# EAGLE design DesktopMini (EAGLE 9.4.2)
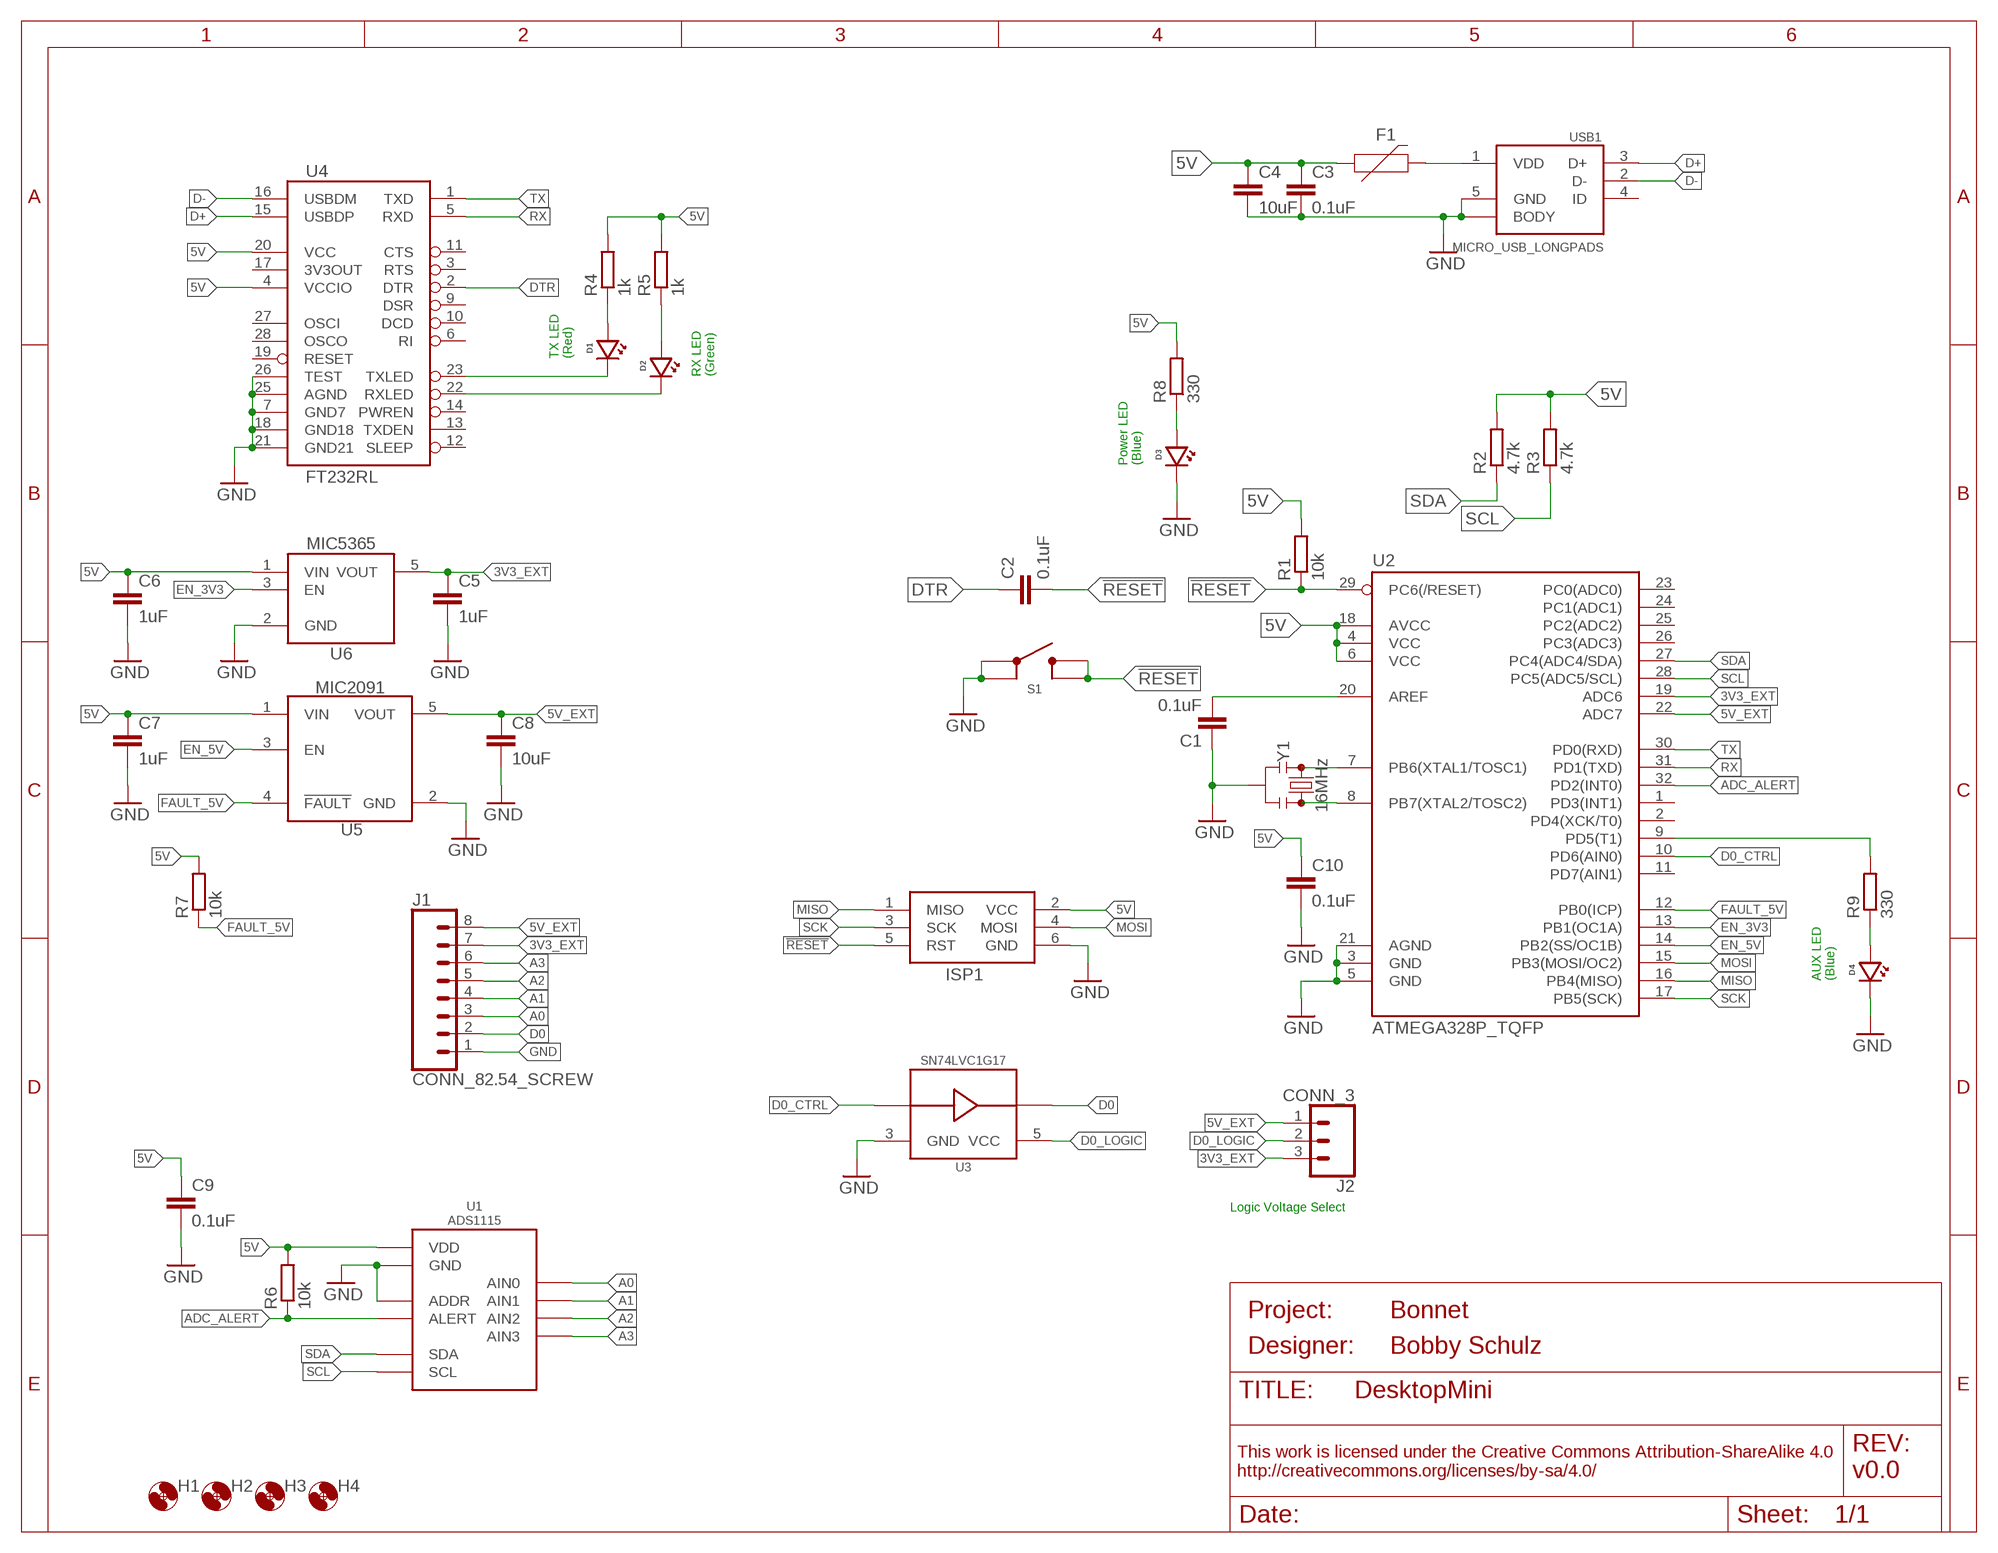
[diagram p0: schematic, sheet 1]
FRAME1 (FRAME_A_L): DESIGNER: Bobby Schulz; PROJECT: Bonnet; REV: v0.0

## Parts
C1  0.1uF  C-EU0.1UFC0603  [C0603]
C2  0.1uF  C-EU0.1UFC0603  [C0603]
C3  0.1uF  C-EU0.1UFC0603  [C0603]
C4  10uF  C-EU10UFC0805  [C0805]
C5  1uF  C-EU1UFC0603  [C0603]
C6  1uF  C-EU1UFC0603  [C0603]
C7  1uF  C-EU1UFC0603  [C0603]
C8  10uF  C-EU10UFC0805  [C0805]
C9  0.1uF  C-EU0.1UFC0603  [C0603]
C10  0.1uF  C-EU0.1UFC0603  [C0603]
D1  LEDRED0603  [LED_0603]
D2  LEDGREEN0603  [LED_0603]
D3  LEDBLUE0603  [LED_0603]
D4  LEDBLUE0603  [LED_0603]
F1  PPTC_HALF-AMP  [1206]
H1  MOUNTING_HOLE4_NP  [4_40]
H2  MOUNTING_HOLE4_NP  [4_40]
H3  MOUNTING_HOLE4_NP  [4_40]
H4  MOUNTING_HOLE4_NP  [4_40]
ISP1  AVRISP-6  [AVRISP]
J1  CONN_82.54_SCREW  [1X08_SCREW]
J2  CONN_3  [1X03]
R1  10k  R-EU_10KR0603  [R0603]
R2  4.7k  R-EU_4.7KR0603  [R0603]
R3  4.7k  R-EU_4.7KR0603  [R0603]
R4  1k  R-EU_1KR0603  [R0603]
R5  1k  R-EU_1KR0603  [R0603]
R6  10k  R-EU_10KR0603  [R0603]
R7  10k  R-EU_10KR0603  [R0603]
R8  330  R-EU_330R0603  [R0603]
R9  330  R-EU_330R0603  [R0603]
S1  BUTTON6X6  [SWITCH_6MM]
U1  ADS1115  [VSSOP_10]
U2  ATMEGA328P_TQFP  ATMEGA328PTQFP_32  [TQFP32-08]
U3  SN74LVC1G17DCK  [DCK_R-PDSO-G5]
U4  FT232RL  FT232RLSSOP  [SSOP28DB]
U5  MIC2091  [SOT23-5]
U6  MIC53653.3SC70  [DCK_R-PDSO-G5]
USB1  MICRO_USB_LONGPADS  [10118194-0001LF_10118194-0001LF_LONGER_PADS]
Y1  16MHz  RESONATOR16MHZSMD_3.2X1.3  [RESONATOR-SMD-3.2X1.3]

## Nets
3V3_EXT: C5.1 J1.7 J2.3 U2.19(ADC6) U6.5(VOUT)
5V: C3.1 C4.1 C6.1 C7.1 C9.1 C10.1 F1.1 ISP1.2(VCC) R1.2 R2.2 R3.2 R4.2 R5.2 R6.2 R7.2 R8.2 U1.8(VDD) U2.4(VCC) U2.6(VCC) U2.18(AVCC) U4.4(VCCIO) U4.20(VCC) U5.1(VIN) U6.1(VIN)
5V_EXT: C8.1 J1.8 J2.1 U2.22(ADC7) U5.5(VOUT)
!RESET: C2.2 ISP1.5(RST) R1.1 S1.3 S1.4 U2.29(PC6(/RESET))
A0: J1.3 U1.4(AIN0)
A1: J1.4 U1.5(AIN1)
A2: J1.5 U1.6(AIN2)
A3: J1.6 U1.7(AIN3)
ADC_ALERT: R6.1 U1.2(ALERT) U2.32(PD2(INT0))
AUX_LED: R9.2 U2.9(PD5(T1))
D0: J1.2 U3.4(Y)
D0_CTRL: U2.10(PD6(AIN0)) U3.2(A)
D0_LOGIC: J2.2 U3.5(VCC)
D+: U4.15(USBDP) USB1.3(D+)
D-: U4.16(USBDM) USB1.2(D-)
DTR: C2.1 U4.2(DTR)
EN_3V3: U2.13(PB1(OC1A)) U6.3(EN)
EN_5V: U2.14(PB2(SS/OC1B)) U5.3(EN)
FAULT_5V: R7.1 U2.12(PB0(ICP)) U5.4(!FAULT)
GND: C1.1 C3.2 C4.2 C5.2 C6.2 C7.2 C8.2 C9.2 C10.2 D3.CATHODE D4.CATHODE ISP1.6(GND) J1.1 S1.1 S1.2 U1.1(ADDR) U1.3(GND) U2.3(GND) U2.5(GND) U2.21(AGND) U3.3(GND) U4.7(GND7) U4.18(GND18) U4.21(GND21) U4.25(AGND) U4.26(TEST) U5.2(GND) U6.2(GND) USB1.5(GND) USB1.BODY@1(BODY) USB1.BODY@2(BODY) USB1.BODY@3(BODY) USB1.BODY@4(BODY) USB1.BODY@7(BODY) USB1.BODY@8(BODY) Y1.2
MISO: ISP1.1(MISO) U2.16(PB4(MISO))
MOSI: ISP1.4(MOSI) U2.15(PB3(MOSI/OC2))
N$1: U2.7(PB6(XTAL1/TOSC1)) Y1.1
N$2: U2.8(PB7(XTAL2/TOSC2)) Y1.3
N$3: C1.2 U2.20(AREF)
N$5: D1.ANODE R4.1
N$6: F1.2 USB1.1(VDD)
N$7: D2.ANODE R5.1
N$8: D1.CATHODE U4.23(TXLED)
N$9: D2.CATHODE U4.22(RXLED)
N$10: D3.ANODE R8.1
N$11: D4.ANODE R9.1
RX: U2.31(PD1(TXD)) U4.5(RXD)
SCK: ISP1.3(SCK) U2.17(PB5(SCK))
SCL: R3.1 U1.10(SCL) U2.28(PC5(ADC5/SCL))
SDA: R2.1 U1.9(SDA) U2.27(PC4(ADC4/SDA))
TX: U2.30(PD0(RXD)) U4.1(TXD)
Unconnected: U2.1(PD3(INT1)) U2.2(PD4(XCK/T0)) U2.11(PD7(AIN1)) U2.23(PC0(ADC0)) U2.24(PC1(ADC1)) U2.25(PC2(ADC2)) U2.26(PC3(ADC3)) U4.3(RTS) U4.6(RI) U4.9(DSR) U4.10(DCD) U4.11(CTS) U4.12(SLEEP) U4.13(TXDEN) U4.14(PWREN) U4.17(3V3OUT) U4.19(RESET) U4.27(OSCI) U4.28(OSCO) USB1.4(ID)

## Notes on the sheet
- TX LED
  (Red)
- RX LED
  (Green)
- Power LED
  (Blue)
- AUX LED
  (Blue)
- Logic Voltage Select

## Library data of the parts
C1-C3 C9 C10 = bschulz_passives:C-EU: CAPACITOR, European symbol; DIGIKEY: 490-6051-1-ND; MF: Murata; MPN: GCM188R71E104KA57D
C4 C8 = bschulz_passives:C-EU: CAPACITOR, European symbol; DIGIKEY: 490-6473-6-ND; MF: Murata; MPN: GRM21BR61C106KE15K
C5-C7 = bschulz_passives:C-EU: CAPACITOR, European symbol; DIGIKEY: 587-1251-1-ND; MF: Yaiyo Yuden; MPN: EMK107BJ105KA-T
D1 = bschulz:LED: Genaric LED; DIGIKEY: 732-4978-1-ND; MF: Wurth; MPN: 150060RS75000
D2 = bschulz:LED: Genaric LED; DIGIKEY: 732-4971-1-ND; MF: Wurth; MPN: 150060GS75000
D3 D4 = bschulz:LED: Genaric LED; DIGIKEY: 732-4966-1-ND; MF: Wurth; MPN: 150060BS75000
F1 = bschulz:PPTC: Bel Fuse PPTC; DIGIKEY: MF-NSMF020-2CT-ND; MF: Bourns; MPN: MF-NSMF020-2
H1-H4 = bschulz:MOUNTING_HOLE: Genaric Mechanical Mounting Hole Hole diameter based on max body diameter + 15% Keepout ring is for diameter of socket cap screw (minimum required clearance) TPlace ring is for diameter of pan head screw (recomended clearance) Specifications: Socket Cap <http://fastener-express.com/fastener-technical/SocketscapSS-Alloy.pdf> Button Head Socket Cap <http://fastener-express.com/fastener-technical/Button-Socket-alloy.pdf> Pan Head <http://fastener-express.com/fastener-technical/pan-machine-Screws.pdf>; DIGIKEY: DNP; MF: N/A; MPN: DNP
ISP1 = bschulz:AVRISP: AVR ISP HEADER Standard 6 pin header for AVR programming
J1 = bschulz:CONN_8: Genaric 8 terminal header Digikey 2.54_SCREW <https://www.digikey.com/product-detail/en/on-shore-technology-inc/OSTVN06A150/ED10565-ND/1588866>; DIGIKEY: ED10566-ND; MF: On Shore; MPN: OSTVN08A150
J2 = bschulz:CONN_3: Genaric 3 terminal header Digikey 2.54_SCREW <https://www.digikey.com/product-detail/en/on-shore-technology-inc/OSTVN03A150/ED10562-ND/1588863> 3.5_SCREW <https://www.digikey.com/product-detail/en/on-shore-technology-inc/OSTTE030161/ED2636-ND/614585>
R1 R6 R7 = bschulz_passives:R-EU_: RESISTOR, European symbol Digikey Parts: Yageo, 0402 <https://www.digikey.com/products/en/resistors/chip-resistor-surface-mount/52?k=&pkeyword=&sv=0&s=4356&sf=1&FV=-1%7C13%2C7%7C2%2C1291%7C39157%2C1989%7C0%2C-8%7C52%2C3%7C1131%2C3%7C2503&quantity=&ColumnSort=0&page=1&stock=1&pageSize=25> Yageo, 0603 <https://www.digikey.com/products/en/resistors/chip-resistor-surface-mount/52?k=&pkeyword=&sv=0&pv1291=39245&sf=1&FV=-5%7C4356%2C-5%7C47360%2C-8%7C52%2C-1%7C13%2C7%7C2%2C1989%7C0&quantity=10&ColumnSort=1000011&page=1&stock=1&pageSize=25> Panasonic, 0603 <https://www.digikey.com/products/en/resistors/chip-resistor-surface-mount/52?k=&pkeyword=&pv252=68&sf=0&FV=ffec373d%2C1c0002%2C142c040c%2C1f140000%2Cffe00034%2C80002%2Cc0001&quantity=&ColumnSort=0&page=1&stock=1&pageSize=25> Panasonic, precision, 0603 <https://www.digikey.com/products/en/resistors/chip-resistor-surface-mount/52?FV=ffec4907%2Cfffc000a%2Cc0172%2C142c040c%2C1f140000%2Cffe00034%2C1c0002&quantity=100&ColumnSort=2085&page=1&stock=1&pageSize=25> Panasonic, 0805 <https://www.digikey.com/products/en/resistors/chip-resistor-surface-mount/52?k=&pkeyword=&pv3=1&sf=0&FV=ffec373d%2C1c0002%2C1f140000%2Cffe00034%2C142c040d&quantity=&ColumnSort=0&page=1&stock=1&pageSize=25> Rohm, current sense <https://www.digikey.com/products/en/resistors/chip-resistor-surface-mount/52?k=&pkeyword=&pv3=1&sf=0&FV=ffecb688%2C1f140000%2Cffe00034%2C1c0002&quantity=&ColumnSort=0&page=1&stock=1&pageSize=25> Vishay, pulse proof automotive <https://www.digikey.com/products/en/resistors/chip-resistor-surface-mount/52?k=&pkeyword=&pv7=2&sf=0&FV=ffec5d6b%2Cffe00034%2C1f140000&quantity=&ColumnSort=0&page=1&stock=1&pageSize=25>; DIGIKEY: 311-10.0KHRCT-ND; MF: Yageo; MPN: RC0603FR-0710KL; VALUE_PART: 10k
R2 R3 = bschulz_passives:R-EU_: RESISTOR, European symbol Digikey Parts: Yageo, 0402 <https://www.digikey.com/products/en/resistors/chip-resistor-surface-mount/52?k=&pkeyword=&sv=0&s=4356&sf=1&FV=-1%7C13%2C7%7C2%2C1291%7C39157%2C1989%7C0%2C-8%7C52%2C3%7C1131%2C3%7C2503&quantity=&ColumnSort=0&page=1&stock=1&pageSize=25> Yageo, 0603 <https://www.digikey.com/products/en/resistors/chip-resistor-surface-mount/52?k=&pkeyword=&sv=0&pv1291=39245&sf=1&FV=-5%7C4356%2C-5%7C47360%2C-8%7C52%2C-1%7C13%2C7%7C2%2C1989%7C0&quantity=10&ColumnSort=1000011&page=1&stock=1&pageSize=25> Panasonic, 0603 <https://www.digikey.com/products/en/resistors/chip-resistor-surface-mount/52?k=&pkeyword=&pv252=68&sf=0&FV=ffec373d%2C1c0002%2C142c040c%2C1f140000%2Cffe00034%2C80002%2Cc0001&quantity=&ColumnSort=0&page=1&stock=1&pageSize=25> Panasonic, precision, 0603 <https://www.digikey.com/products/en/resistors/chip-resistor-surface-mount/52?FV=ffec4907%2Cfffc000a%2Cc0172%2C142c040c%2C1f140000%2Cffe00034%2C1c0002&quantity=100&ColumnSort=2085&page=1&stock=1&pageSize=25> Panasonic, 0805 <https://www.digikey.com/products/en/resistors/chip-resistor-surface-mount/52?k=&pkeyword=&pv3=1&sf=0&FV=ffec373d%2C1c0002%2C1f140000%2Cffe00034%2C142c040d&quantity=&ColumnSort=0&page=1&stock=1&pageSize=25> Rohm, current sense <https://www.digikey.com/products/en/resistors/chip-resistor-surface-mount/52?k=&pkeyword=&pv3=1&sf=0&FV=ffecb688%2C1f140000%2Cffe00034%2C1c0002&quantity=&ColumnSort=0&page=1&stock=1&pageSize=25> Vishay, pulse proof automotive <https://www.digikey.com/products/en/resistors/chip-resistor-surface-mount/52?k=&pkeyword=&pv7=2&sf=0&FV=ffec5d6b%2Cffe00034%2C1f140000&quantity=&ColumnSort=0&page=1&stock=1&pageSize=25>; DIGIKEY: 311-4.70KHRCT-ND; MF: Yageo; MPN: RC0603FR-074K7L; VALUE_PART: 4.7k
R4 R5 = bschulz_passives:R-EU_: RESISTOR, European symbol Digikey Parts: Yageo, 0402 <https://www.digikey.com/products/en/resistors/chip-resistor-surface-mount/52?k=&pkeyword=&sv=0&s=4356&sf=1&FV=-1%7C13%2C7%7C2%2C1291%7C39157%2C1989%7C0%2C-8%7C52%2C3%7C1131%2C3%7C2503&quantity=&ColumnSort=0&page=1&stock=1&pageSize=25> Yageo, 0603 <https://www.digikey.com/products/en/resistors/chip-resistor-surface-mount/52?k=&pkeyword=&sv=0&pv1291=39245&sf=1&FV=-5%7C4356%2C-5%7C47360%2C-8%7C52%2C-1%7C13%2C7%7C2%2C1989%7C0&quantity=10&ColumnSort=1000011&page=1&stock=1&pageSize=25> Panasonic, 0603 <https://www.digikey.com/products/en/resistors/chip-resistor-surface-mount/52?k=&pkeyword=&pv252=68&sf=0&FV=ffec373d%2C1c0002%2C142c040c%2C1f140000%2Cffe00034%2C80002%2Cc0001&quantity=&ColumnSort=0&page=1&stock=1&pageSize=25> Panasonic, precision, 0603 <https://www.digikey.com/products/en/resistors/chip-resistor-surface-mount/52?FV=ffec4907%2Cfffc000a%2Cc0172%2C142c040c%2C1f140000%2Cffe00034%2C1c0002&quantity=100&ColumnSort=2085&page=1&stock=1&pageSize=25> Panasonic, 0805 <https://www.digikey.com/products/en/resistors/chip-resistor-surface-mount/52?k=&pkeyword=&pv3=1&sf=0&FV=ffec373d%2C1c0002%2C1f140000%2Cffe00034%2C142c040d&quantity=&ColumnSort=0&page=1&stock=1&pageSize=25> Rohm, current sense <https://www.digikey.com/products/en/resistors/chip-resistor-surface-mount/52?k=&pkeyword=&pv3=1&sf=0&FV=ffecb688%2C1f140000%2Cffe00034%2C1c0002&quantity=&ColumnSort=0&page=1&stock=1&pageSize=25> Vishay, pulse proof automotive <https://www.digikey.com/products/en/resistors/chip-resistor-surface-mount/52?k=&pkeyword=&pv7=2&sf=0&FV=ffec5d6b%2Cffe00034%2C1f140000&quantity=&ColumnSort=0&page=1&stock=1&pageSize=25>; DIGIKEY: 311-1KLDCT-ND; MF: Yageo; MPN: AC0603FR-071KL; VALUE_PART: 1k
R8 R9 = bschulz_passives:R-EU_: RESISTOR, European symbol Digikey Parts: Yageo, 0402 <https://www.digikey.com/products/en/resistors/chip-resistor-surface-mount/52?k=&pkeyword=&sv=0&s=4356&sf=1&FV=-1%7C13%2C7%7C2%2C1291%7C39157%2C1989%7C0%2C-8%7C52%2C3%7C1131%2C3%7C2503&quantity=&ColumnSort=0&page=1&stock=1&pageSize=25> Yageo, 0603 <https://www.digikey.com/products/en/resistors/chip-resistor-surface-mount/52?k=&pkeyword=&sv=0&pv1291=39245&sf=1&FV=-5%7C4356%2C-5%7C47360%2C-8%7C52%2C-1%7C13%2C7%7C2%2C1989%7C0&quantity=10&ColumnSort=1000011&page=1&stock=1&pageSize=25> Panasonic, 0603 <https://www.digikey.com/products/en/resistors/chip-resistor-surface-mount/52?k=&pkeyword=&pv252=68&sf=0&FV=ffec373d%2C1c0002%2C142c040c%2C1f140000%2Cffe00034%2C80002%2Cc0001&quantity=&ColumnSort=0&page=1&stock=1&pageSize=25> Panasonic, precision, 0603 <https://www.digikey.com/products/en/resistors/chip-resistor-surface-mount/52?FV=ffec4907%2Cfffc000a%2Cc0172%2C142c040c%2C1f140000%2Cffe00034%2C1c0002&quantity=100&ColumnSort=2085&page=1&stock=1&pageSize=25> Panasonic, 0805 <https://www.digikey.com/products/en/resistors/chip-resistor-surface-mount/52?k=&pkeyword=&pv3=1&sf=0&FV=ffec373d%2C1c0002%2C1f140000%2Cffe00034%2C142c040d&quantity=&ColumnSort=0&page=1&stock=1&pageSize=25> Rohm, current sense <https://www.digikey.com/products/en/resistors/chip-resistor-surface-mount/52?k=&pkeyword=&pv3=1&sf=0&FV=ffecb688%2C1f140000%2Cffe00034%2C1c0002&quantity=&ColumnSort=0&page=1&stock=1&pageSize=25> Vishay, pulse proof automotive <https://www.digikey.com/products/en/resistors/chip-resistor-surface-mount/52?k=&pkeyword=&pv7=2&sf=0&FV=ffec5d6b%2Cffe00034%2C1f140000&quantity=&ColumnSort=0&page=1&stock=1&pageSize=25>; DIGIKEY: 311-330HRCT-ND; MF: Yageo; MPN: RC0603FR-07330RL; VALUE_PART: 330
S1 = bschulz:BUTTON: Genaric SPST Push button
U1 = bschulz:ADS111*: ADS1115 - Sigma Delta ADC Characteristics: VCC: 2~5.5V Resolution: 16 bits (12 bits for ADS1015) Number of Inputs: 4 (2 Differenital) Sample Rate: 860 Samples Per Second (3300 for ADS1015) Operating Temperature: -40°C to 125°C Digikey: 296-38849-1-ND (ADS1115) <https://www.digikey.com/scripts/DkSearch/dksus.dll?Detail&itemSeq=258904888&uq=636603311183646020> 296-41185-1-ND (ADS1015) <https://www.digikey.com/product-detail/en/texas-instruments/ADS1015IDGSR/296-41185-1-ND/5222640>; DIGIKEY: 296-38849-1-ND; MF: TI; MPN: ADS1115IDGSR
U2 = bschulz:ATMEGA328P: Popular 328P in QFP Storefront component: ATmega328 - TQFP <https://www.sparkfun.com/products/13448> (COM-13448) Datasheet <http://www.sparkfun.com/datasheets/Components/SMD/ATMega328.pdf> SparkFun Products SparkFun RedBoard - Programmed with Arduino <https://www.sparkfun.com/products/12757> (DEV-12757) Arduino Pro Mini 328 - 5V/16MHz <https://www.sparkfun.com/products/11113> (DEV-11113) Arduino Pro Mini 328 - 3.3V/8MHz <https://www.sparkfun.com/products/11114> (DEV-11114) SparkFun OpenLog <https://www.sparkfun.com/products/13712> (DEV-13712) SparkFun MicroView - OLED Arduino Module <https://www.sparkfun.com/products/12923> (DEV-12923) SparkFun Digital Sandbox <https://www.sparkfun.com/products/12651> (DEV-12651) SparkFun PicoBoard <https://www.sparkfun.com/products/11888> (WIG-11888) Arduino Fio <https://www.sparkfun.com/products/10116> (DEV-10116) LilyPad Arduino 328 Main Board <https://www.sparkfun.com/products/13342> (DEV-13342) SparkFun RedStick <https://www.sparkfun.com/products/13741> (DEV-13741) LilyPad MP3 <https://www.sparkfun.com/products/11013> (DEV-11013) LilyPad Arduino SimpleSnap <https://www.sparkfun.com/products/10941> (DEV-10941) SparkFun Stepoko <https://www.sparkfun.com/products/13899> (ROB-13899) SparkFun Geiger Counter <https://www.sparkfun.com/products/11345> (SEN-11345) SparkFun EL Sequencer <https://www.sparkfun.com/products/12781> (COM-12781) Arduino Pro 328 - 5V/16MHz <https://www.sparkfun.com/products/10915> (DEV-10915) CryptoCape <https://www.sparkfun.com/products/12773> (DEV-12773) SparkFun IR Thermometer Evaluation Board - MLX90614 <https://www.sparkfun.com/products/10740> (SEN-10740) SparkFun RedBot Mainboard <https://www.sparkfun.com/products/12097> (ROB-12097) Arduino Pro 328 - 3.3V/8MHz <https://www.sparkfun.com/products/10914> (DEV-10914) SparkFun Block for Intel® Edison - Arduino <https://www.sparkfun.com/products/13036> (DEV-13036) SparkFun Simon Says - Surface Mount Soldering Kit <https://www.sparkfun.com/products/10935> (KIT-10935) SparkFun 7-Segment Serial Display - Red <https://www.sparkfun.com/products/11441> (COM-11441) SparkFun 7-Segment Serial Display - White <https://www.sparkfun.com/products/11629> (COM-11629) SparkFun 7-Segment Serial Display - Yellow <https://www.sparkfun.com/products/11443> (COM-11443) SparkFun 7-Segment Serial Display - Kelly Green <https://www.sparkfun.com/products/11440> (COM-11440) SparkFun 7-Segment Serial Display - Blue <https://www.sparkfun.com/products/11442> (COM-11442) SparkFun OpenSegment Serial Display - 20mm (Blue) <https://www.sparkfun.com/products/11647> (COM-11647) SparkFun OpenSegment Serial Display - 20mm (Green) <https://www.sparkfun.com/products/11646> (COM-11646) SparkFun OpenSegment Serial Display - 20mm (White) <https://www.sparkfun.com/products/11648> (COM-11648) SparkFun OpenSegment Serial Display - 20mm (Red) <https://www.sparkfun.com/products/11644> (COM-11644) SparkFun OpenSegment Serial Display - 20mm (Yellow) <https://www.sparkfun.com/products/11645> (COM-11645) SparkFun OpenSegment Shield <https://www.sparkfun.com/products/13190> (DEV-13190); DIGIKEY: ATMEGA328PB-AURCT-ND; MF: Atmel; MPN: ATMEGA328PB-AUR; PROD_ID: IC-09069
U3 = bschulz:SN74LVC1G17: SN74LVC1G17 - Single Schmitt Trigger Logic Buffer Characteristics: VCC: 1.65~5.5V Operating Temperature: -40°C to 125°C Number of Gates: 1 /li> Inverting: No 5V Tolerent Input (Down Shift) Digikey: 296-11934-1-ND (SC70, DCK) <https://www.digikey.com/product-detail/en/texas-instruments/SN74LVC1G17DCKR/296-11934-1-ND/389052>; DIGIKEY: 296-11934-1-ND; DISP: SN74LVC1G17; MF: TI; MPN: SN74LVC1G17DCKR
U4 = bschulz:FT232RL: FT232RL USB UART FT232RL 4th Generation USB UART (USB <-> Serial) Controller. Datasheet <http://www.sparkfun.com/datasheets/IC/FT232R_v104.pdf> SparkFun Products Component <https://www.sparkfun.com/products/650> (COM-00650) SparkFun RedBot Mainboard <https://www.sparkfun.com/products/12097> (ROB-12097) SparkFun FTDI Basic Breakout - 5V <https://www.sparkfun.com/products/9716> (DEV-09716) SparkFun FTDI Basic Breakout - 3.3V <https://www.sparkfun.com/products/9873> (DEV-09873) Bus Pirate - v3.6a <https://www.sparkfun.com/products/12942> (TOL-12942) SparkFun USB to Serial Breakout - FT232RL <https://www.sparkfun.com/products/12731> (BOB-12731) SparkFun PicoBoard <https://www.sparkfun.com/products/11888> (WIG-11888) SparkFun RFID USB Reader <https://www.sparkfun.com/products/9963> (SEN-09963) LilyPad FTDI Basic Breakout - 5V <https://www.sparkfun.com/products/10275> (DEV-10275) SparkFun Stepoko <https://www.sparkfun.com/products/13899> (ROB-13899); PROD_ID: IC-00870
U5 = bschulz:MIC209*: MIC209x - Hight Side Load Switch, with Fixed Current Limit Characteristics: Vin: 1.8v ~ 5.5v IQ: 5μA (OFF), 70μA (ON) RDS(ON): 700mΩ (Vin = 5v), 790mΩ (Vin = 3.3v) UVLO: 1.75V Output Current: 50/100mA (MIC2090/MIC2091) Operating Temperature: -40°C to 125°C Digikey: MIC2091-1 <https://www.digikey.com/product-detail/en/microchip-technology/MIC2091-1YM5-TR/576-3891-1-ND/2650466> MIC2090-1 <https://www.digikey.com/product-detail/en/microchip-technology/MIC2090-1YM5-TR/576-3890-1-ND/2650465>; DIGIKEY: 576-3891-1-ND; DISP: MIC2091; MF: Microchip; MPN: MIC2091-1YM5-TR
U6 = bschulz:MIC5365: MIC5365-* - Low Power, High Performance, Linear Regulator Characteristics: Vin: 2.5V ~ 5.5V Vout: Many options, (1v ~ 3.3v) see datasheet <http://ww1.microchip.com/downloads/en/DeviceDoc/mic5365.pdf> IQ: 29μA typ Dropout Voltage: 55mV @ 50mA, input ≥ 2.8v Voltage Accuracy: 2% typ Output Current: 150 mA Operating Temperature: -40°C to 125°C Mouser: MIC5365-3.3YC5 (3.3V Fixed) <https://www.digikey.com/product-detail/en/microchip-technology/MIC5365-3.3YC5-TR/576-3193-1-ND/1868230> MIC5365-1.8YC5 (1.8V Fixed) <https://www.digikey.com/products/en/integrated-circuits-ics/pmic-voltage-regulators-linear/699?k=mic5365&k=&pkeyword=mic5365&sv=0&pv1291=881&sf=0&FV=1c0002%2C1f140000%2Cffe002bb%2C1bcc0020&quantity=&ColumnSort=0&page=1&stock=1&pageSize=25>; DIGIKEY: 576-3193-1-ND; MF: Microchip; MPN: MIC5365-3.3YC5-TR
USB1 = bschulz:MICRO_USB_LONGPADS; DIGIKEY: 609-4618-1-ND; MF: Amphenol; MPN: 10118194-0001LF
Y1 = bschulz:RESONATOR: 16MHz Resonator Digikey Example <http://www.digikey.com/product-detail/en/murata-electronics-north-america/CSTCE16M0V53-R0/490-1198-1-ND/584635> Frequency: 16MHz Frequency Stability: ±0.3% Frequency Tolerance: ±0.5% Capacitance: 15pF SparkFun Products SparkFun OpenLog <https://www.sparkfun.com/products/13712> SparkFun MicroView - OLED Arduino Module <https://www.sparkfun.com/products/12923>; DIGIKEY: 490-17948-1-ND; MF: Murata; MPN: CSTNE16M0V530000R0

## Board
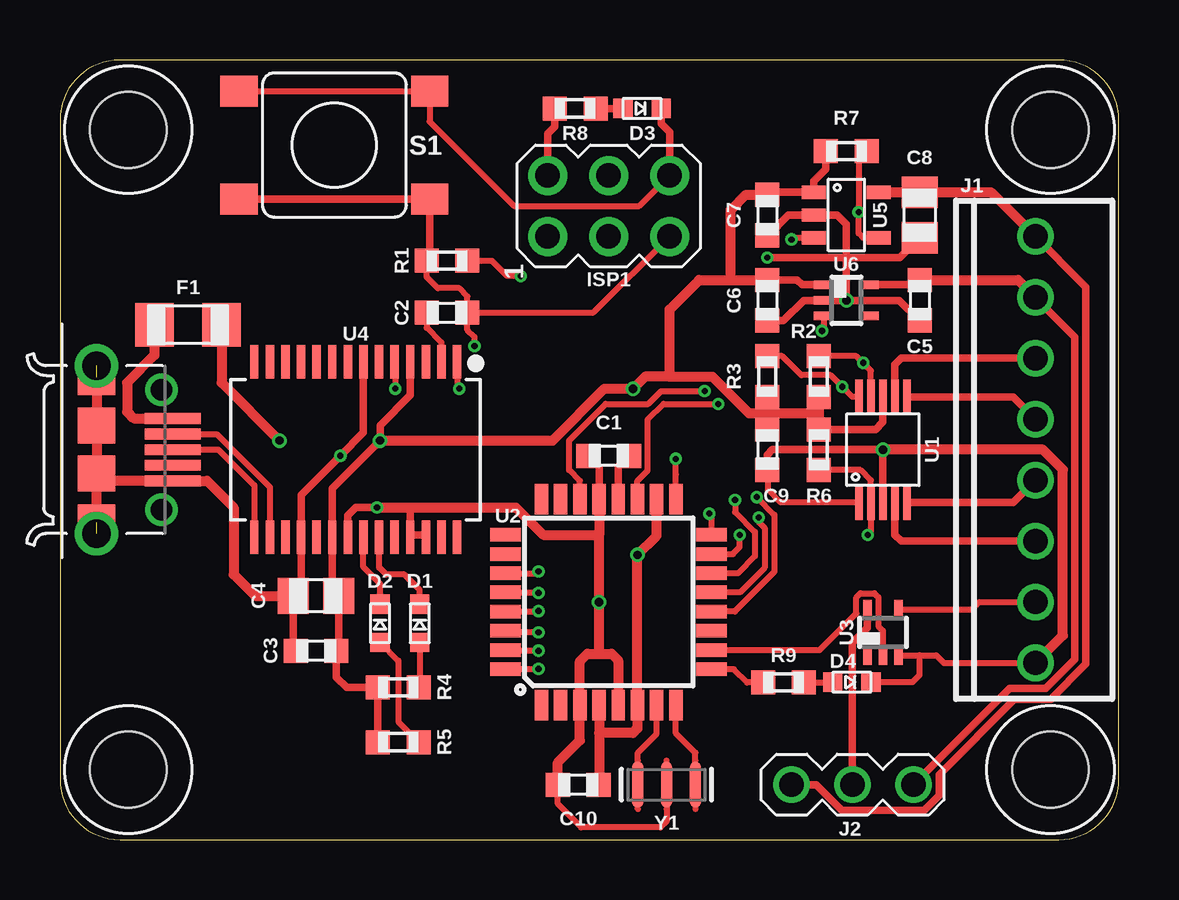
[diagram p1: board, top side]
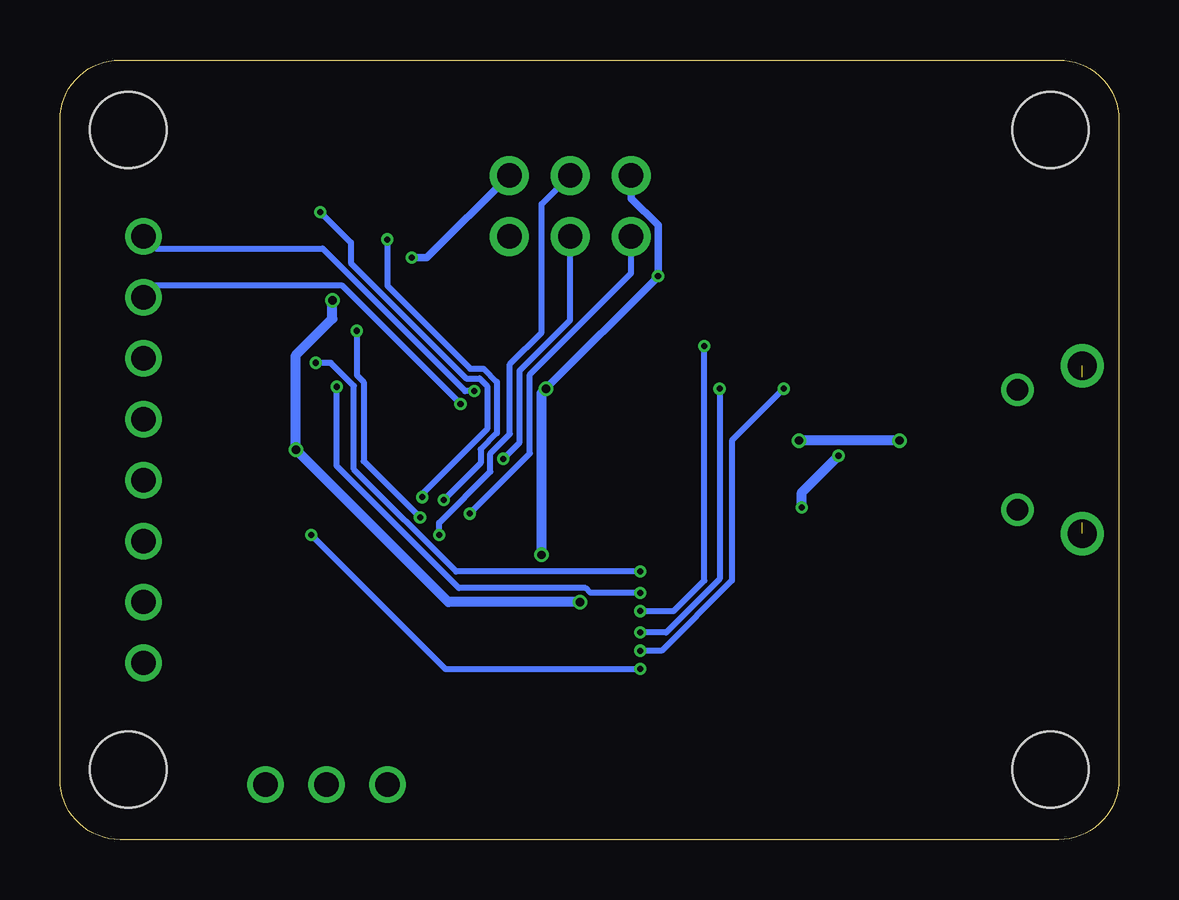
[diagram p2: board, bottom side, seen from below]

Size 44.12 x 32.5 mm. Coordinates in mm from the lower left corner, seen from the top.
Outline: 0,30 0,2.5 arc90 2.5,0 41.62,0 arc90 44.12,2.5 44.12,30 arc90 41.62,32.5 2.5,32.5 arc90 0,30
Copper layers (1*16): Top 0.035559375mm / dielectric 1.6mm / Bottom 0.035559375mm
Design rules "oshpark-2layer": minimum track width 6mil, minimum drill 10mil, track to track 6mil, track to pad 6mil, pad to pad 6mil, via to via 6mil, smd to smd 6mil, copper to edge 15mil, drill to drill 6mil, minimum pad ring 5mil, minimum via ring 5mil, stop-mask expansion 2.5mil, vias tented up to drill 0mil, thermal gap 10mil

### Footprints (pad centres in the part's own frame; a part is rotated, then mirrored left to right if it is on the bottom)
C0603 = smd 1 x 1: 1 -0.85,0; 2 0.85,0
C0805 = smd 1.3 x 1.5: 1 -0.95,0; 2 0.95,0
LED_0603 = smd 0.8 x 0.8: ANODE 0.8,0; CATHODE -0.8,0
1206 = smd 1.6 x 1.8: 1 -1.4,0; 2 1.4,0
4_40 = hole 3.175: 0,0
AVRISP = drill 1.02 pad 1.626: 1 -1.27,2.54; 2 1.27,2.54; 3 -1.27,0; 4 1.27,0; 5 -1.27,-2.54; 6 1.27,-2.54
1X08_SCREW = drill 1.016: 1 -8.89,0; 2 -6.35,0; 3 -3.81,0; 4 -1.27,0; 5 1.27,0; 6 3.81,0; 7 6.35,0; 8 8.89,0
1X03 = drill 1.016: 1 -2.54,0; 2 0,0; 3 2.54,0
R0603 = smd 1 x 1: 1 -0.85,0; 2 0.85,0
SWITCH_6MM = smd 1.55 x 1.3: 1 -3.975,2.25; 2 3.975,2.25; 3 -3.975,-2.25; 4 3.975,-2.25
VSSOP_10 = smd 0.3 x 1.45: 1 -1,-2.2; 2 -0.5,-2.2; 3 0,-2.2; 4 0.5,-2.2; 5 1,-2.2; 6 1,2.2; 7 0.5,2.2; 8 0,2.2; 9 -0.5,2.2; 10 -1,2.2
TQFP32-08 = smd 1.27 x 0.559: 1 -4.293,2.8; 2 -4.293,2; 3 -4.293,1.2; 4 -4.293,0.4; 5 -4.293,-0.4; 6 -4.293,-1.2; 7 -4.293,-2; 8 -4.293,-2.8; 17 4.293,-2.8; 18 4.293,-2; 19 4.293,-1.2; 20 4.293,-0.4; 21 4.293,0.4; 22 4.293,1.2; 23 4.293,2; 24 4.293,2.8 | smd 0.559 x 1.27: 9 -2.8,-4.293; 10 -2,-4.293; 11 -1.2,-4.293; 12 -0.4,-4.293; 13 0.4,-4.293; 14 1.2,-4.293; 15 2,-4.293; 16 2.8,-4.293; 25 2.8,4.293; 26 2,4.293; 27 1.2,4.293; 28 0.4,4.293; 29 -0.4,4.293; 30 -1.2,4.293; 31 -2,4.293; 32 -2.8,4.293
DCK_R-PDSO-G5 = smd 0.35 x 0.8: 1 -0.65,-0.95; 2 0,-0.95; 3 0.65,-0.95; 4 0.65,0.95; 5 -0.65,0.95
SSOP28DB = smd 0.348 x 1.397: 1 -4.225,-3.656; 2 -3.575,-3.656; 3 -2.925,-3.656; 4 -2.275,-3.656; 5 -1.625,-3.656; 6 -0.975,-3.656; 7 -0.325,-3.656; 8 0.325,-3.656; 9 0.975,-3.656; 10 1.625,-3.656; 11 2.275,-3.656; 12 2.925,-3.656; 13 3.575,-3.656; 14 4.225,-3.656; 15 4.225,3.656; 16 3.575,3.656; 17 2.925,3.656; 18 2.275,3.656; 19 1.625,3.656; 20 0.975,3.656; 21 0.325,3.656; 22 -0.325,3.656; 23 -0.975,3.656; 24 -1.625,3.656; 25 -2.275,3.656; 26 -2.925,3.656; 27 -3.575,3.656; 28 -4.225,3.656
SOT23-5 = smd 0.55 x 1: 1 -0.95,-1.35; 2 0,-1.35; 3 0.95,-1.35; 4 0.95,1.35; 5 -0.95,1.35
10118194-0001LF_10118194-0001LF_LONGER_PADS = smd 0.45 x 2.35: 1 -1.3,3.175; 2 -0.65,3.175; 3 0,3.175; 4 0.65,3.175; 5 1.3,3.175 | drill 0.9: BBODY@1 -2.5,2.7; BBODY@2 2.5,2.7 | drill 1.2: BODY@1 -3.5,0; BODY@4 3.5,0 | smd 1.5 x 1.55: BODY@2 -1,0; BODY@3 1,0; BODY@7 -3.032,0; BODY@8 3.032,0
RESONATOR-SMD-3.2X1.3 = smd 0.45 x 1.905: 1 -1.2,0; 2 0,0; 3 1.2,0

### Placement (x,y rotation side)
C1  22.86,16 0 top
C2  16.13,21.97 0 top
C3  10.67,7.87 180 top
C4  10.67,10.16 180 top
C5  35.81,22.48 270 top
C6  29.46,22.48 270 top
C7  29.46,26.04 270 top
C8  35.81,26.04 270 top
C9  29.46,16.26 270 top
C10  21.59,2.29 180 top
D1  14.99,9.02 270 top
D2  13.34,9.02 270 top
D3  24.26,30.48 180 top
D4  32.99,6.57 180 top
F1  5.33,21.46 180 top
H1  41.27,29.59 0 top
H2  41.27,2.92 0 top
H3  2.85,29.59 0 top
H4  2.85,2.92 0 top
ISP1  22.86,26.42 90 top
J1  40.64,16.26 90 top
J2  33.02,2.29 0 top
R1  16.13,24.13 0 top
R2  31.62,19.3 270 top
R3  29.46,19.3 270 top
R4  14.1,6.35 180 top
R5  14.1,4.06 180 top
R6  31.62,16.26 90 top
R7  32.77,28.7 180 top
R8  21.46,30.48 180 top
R9  30.15,6.55 180 top
S1  11.43,28.96 0 top
U1  34.29,16.26 0 top
U2  22.86,9.91 90 top
U3  34.29,8.64 0 top
U4  12.32,16.26 180 top
U5  32.77,26.04 270 top
U6  32.77,22.48 270 top
USB1  1.52,16.26 270 top
Y1  25.27,2.29 0 top

### Tracks (layer width: path | path; a pad name or v marks a point on that pad's centre or on a via)
3V3_EXT  (via drill 0.25)
  Top 0.254: U2.19 24.06,14.96 24.49,15.39 24.49,17.5 25.15,18.16 v27.43,18.16
  Top 0.305: U6.5 35.61,23.13 C5.1 | J2.3 39.57,6.3 41.08,6.3 42.29,7.51 42.29,20.94 40.64,22.59 J1.7
  Top 0.406: C5.1 39.92,23.33 J1.7
  Bottom 0.254: v27.43,18.16 32.38,23.11 40.13,23.11 J1.7
5V  (via drill 0.25, 0.35)
  Top 0.254: R1.2 18,24.13 18.63,23.5 v19.2,23.5 | R3.2 29.46,17.78
  Top 0.305: U4.4 14.59,18.53 13.34,17.27 v13.34,16.64 11.34,14.65 U4.20 11.34,10.43 C4.1 11.62,7.97 C3.1 11.52,6.77 11.94,6.35 R4.2 R5.2 | C7.1 29.56,26.98 U5.1 31.42,27.44 31.92,27.94 R7.2 | C6.1 30.73,23.33 30.93,23.13 U6.1 | U1.8 34.29,17.4 34,17.11 R6.2 | 29.46,17.78 C9.1 | R8.2 20.61,29.72 20.32,29.43 ISP1.2
  Top 0.406: U2.4 22.46,4.45 | 22.46,4.45 22.46,2.31 C10.1 | 22.46,4.45 23.88,4.45 24.06,4.63 U2.6 v24.06,11.87 24.86,12.67 U2.18 | F1.1 6.73,19.05 v9.14,16.64 | v13.34,16.64 20.53,16.64 22.69,18.8 v23.88,18.8 24.38,19.3 25.4,19.3 | 25.4,19.3 25.4,22.1 26.63,23.33 27.94,23.33 | 27.94,23.33 C6.1 | 27.94,23.33 27.94,26.25 28.57,26.89 C7.1 | 25.4,19.3 27.18,19.3 28.7,17.78 29.46,17.78 31.62,17.78 | R2.2 31.62,17.78 | 31.62,17.78 R6.2
  Bottom 0.305: ISP1.2 20.32,26.73 19.2,25.61 v19.2,23.5 19.2,23.47 v23.88,18.8
  Bottom 0.406: v9.14,16.64 v13.34,16.64 13.36,16.66 | v23.88,18.8 24.06,18.61 v24.06,11.87
5V_EXT  (via drill 0.25)
  Top 0.254: U2.22 21.66,14.96 21.21,15.41 21.21,16.64 22.73,18.16 24.51,18.16 25.04,18.69 v26.86,18.69
  Top 0.305: J2.1 31.51,2.29 32.58,1.22 36,1.22 36.63,1.84 36.63,2.71 39.76,5.84 41.27,5.84 42.75,7.32 42.75,23.04 40.51,25.27
  Top 0.406: U5.5 C8.1 38.8,26.98 40.51,25.27 J1.8
  Bottom 0.254: v26.86,18.69 27.24,18.69 33.18,24.64 40.13,24.64 J1.8
!RESET  (via drill 0.25)
  Top 0.254: U2.29 19.92,9.51 v19.94,9.53 | v17.27,20.57 17.27,20.95 16.98,21.25 C2.2 | S1.4 15.82,26.29 | C2.2 16.98,22.64 16.64,22.99 15.75,22.99 15.28,23.46 R1.1 | C2.2 22.23,21.97 ISP1.5
  Top 0.305: S1.3 S1.4 15.4,24.26 R1.1
  Bottom 0.254: v19.94,9.53 18.55,9.53 17.27,10.8 v17.27,20.57
A0
  Top 0.305: J1.3 35.05,12.45 34.79,12.71 U1.4
A1
  Top 0.305: J1.4 39.71,14.06 U1.5
A2
  Top 0.305: U1.6 39.71,18.46 J1.5
A3
  Top 0.305: J1.6 35.05,20.07 34.79,19.8 U1.7
ADC_ALERT  (via drill 0.25)
  Top 0.254: R6.1 33.36,15.41 33.79,14.98 U1.2 33.79,12.84 v33.66,12.7 | v19.94,7.11 v19.93,7.11 U2.32
  Bottom 0.254: v33.66,12.7 28.07,7.11 v19.94,7.11
AUX_LED
  Top 0.254: R9.2 28.63,6.55 28.07,7.11 U2.9
D0
  Top 0.254: U3.4 37.99,9.59 38.31,9.91 J1.2
D0_CTRL
  Top 0.254: U2.10 31.66,7.91 33.19,9.44 33.19,10.1 33.35,10.27 33.93,10.27 34.09,10.1 34.09,8.9 34.29,8.7 U3.2
D0_LOGIC
  Top 0.305: J2.2 33.02,8.2 33.64,8.82 U3.5
D+
  Top 0.254: USB1.3 6.6,16.26 8.09,14.77 U4.15
D-
  Top 0.254: U4.16 8.74,14.69 6.53,16.91 USB1.2
DTR
  Top 0.254: C2.1 15.28,21.34 15.89,20.72 U4.2
EN_3V3  (via drill 0.25)
  Top 0.254: U6.3 31.82,21.27 v31.75,21.21 | v29.12,13.43 29.12,13.24 29.36,12.99 29.36,11.33 28.34,10.31 U2.13
  Bottom 0.254: v31.75,21.21 31.75,19.36 31.47,19.08 31.47,15.78 v29.12,13.43
EN_5V  (via drill 0.25)
  Top 0.254: U5.3 30.55,25.09 v30.48,25.02 | v28.13,14.16 28.13,13.66 28.96,12.83 28.96,11.81 28.25,11.11 U2.14
  Bottom 0.254: v30.48,25.02 30.48,23.09 27.03,19.63 26.47,19.63 25.92,19.08 25.92,16.94 26.59,16.26 26.59,15.69 v28.13,14.16
FAULT_5V  (via drill 0.25)
  Top 0.254: U5.4 33.46,25.09 33.27,25.27 v33.27,26.16 33.27,28.36 R7.1 | v29.03,14.28 29.77,13.54 29.77,11.16 28.11,9.51 U2.12
  Bottom 0.254: v33.27,26.16 32,24.89 32,24.04 27.2,19.23 26.64,19.23 26.32,18.91 26.32,17.11 29.03,14.4 v29.03,14.28
GND  (via drill 0.25, 0.35)  (2 unrouted)
  Top 0.254: Y1.2 25.27,0.76 25.02,0.51 21.72,0.51 20.74,1.49 C10.2 | U1.1 30.01,14.06 29.5,14.57 29.5,15.37 | S1.1 S1.2 | S1.2 15.53,31.21 | S1.2 15.4,29.94 18.93,26.42 24.13,26.42 ISP1.6 | U3.3 35.81,7.69 | 35.81,7.69 36.51,7.69 36.83,7.37 J1.1 | D4.CATHODE 35.52,6.57 35.81,6.86 35.81,7.69
  Top 0.305: C1.1 22.46,15.55 U2.21 | U4.26 15.24,12.7 14.69,12.7 U4.25 14.59,13.83 14.61,13.84 | C3.2 9.72,7.97 C4.2 10.04,10.49 U4.18 10.04,14.36 v11.68,16 12.64,16.96 U4.7 | C7.2 29.5,25.18 30.35,26.04 U5.2 32.38,26.04 32.77,25.65 32.77,24.26 | C6.2 30.14,21.63 30.99,22.48 U6.2 v32.77,22.48 | v13.21,13.84 12.32,13.84 11.99,13.52 U4.21 | 29.5,15.37 C9.2 29.46,16.04 29.68,16.26 v34.29,16.26 U1.3 | C5.2 34.96,22.48 v32.77,22.48 | 32.77,24.26 v32.77,22.48 | C8.2 34.99,24.26 32.77,24.26 | 32.77,24.26 v29.46,24.26 | D3.CATHODE 25.06,29.84 25.4,29.5 ISP1.6
  Top 0.406: 22.46,12.7 v22.46,9.91 22.46,7.77 22.48,7.75 | U2.21 22.46,12.7 | 22.48,7.75 21.97,7.75 21.66,7.44 U2.3 21.66,4.13 20.74,3.21 C10.2 | 22.48,7.75 22.99,7.75 23.26,7.47 U2.5 | C4.2 8.13,10.16 7.24,11.05 7.24,13.84 6.13,14.96 USB1.5 1.62,14.96 1.52,14.86 | 22.46,12.7 20.14,12.7 19,13.84 14.61,13.84 v13.21,13.84 | J1.1 41.78,8.51 41.78,15.42 40.95,16.26 v34.29,16.26 | USB1.BODY@7 USB1.BODY@2 USB1.BODY@3 1.52,14.86 | USB1.BODY@8 1.52,14.86
  Bottom 0.305: v29.46,24.26 28.83,24.26 ISP1.6
  Bottom 0.406: v13.21,13.84 13.21,14.48 v11.68,16 | v22.46,9.91 27.94,9.91 v34.29,16.26 34.29,20.19 32.77,21.72 v32.77,22.48
MISO  (via drill 0.25)
  Top 0.254: U2.16 27.15,13.49 v27.05,13.59
  Bottom 0.254: v27.05,13.59 24.54,16.1 24.54,19.39 20.32,23.61 ISP1.1
MOSI  (via drill 0.25)
  Top 0.254: U2.15 28.04,11.91 28.32,12.19 v28.32,12.7
  Bottom 0.254: v28.32,12.7 28.32,13.21 26.19,15.34 26.19,16.1 25.37,16.91 25.37,19.82 24.05,21.14 24.05,26.49 ISP1.4
N$1
  Top 0.254: Y1.1 24.07,3.63 24.86,4.41 U2.7
N$2
  Top 0.254: Y1.3 26.47,3.63 25.66,4.44 U2.8
N$3
  Top 0.305: U2.20 23.26,15.55 C1.2
N$5
  Top 0.254: D1.ANODE 14.99,6.39 R4.1
N$6
  Top 0.406: F1.2 3.93,20.19 2.79,19.05 2.79,17.84 3.08,17.56 USB1.1
N$7
  Top 0.254: D2.ANODE 14.1,7.46 14.1,4.91 R5.1
N$8
  Top 0.254: D1.CATHODE 14.99,10.41 14.35,11.05 13.59,11.05 13.29,11.34 U4.23
N$9
  Top 0.254: D2.CATHODE 13.34,10.67 12.64,11.36 U4.22
N$10
  Top 0.305: R8.1 D3.ANODE
N$11
  Top 0.254: R9.1 32.18,6.55 D4.ANODE
RX  (via drill 0.25)
  Top 0.254: U4.5 13.97,19.89 v13.97,18.8 | v19.94,7.87 18.6,7.87 U2.31
  Bottom 0.254: v13.97,18.8 16.13,16.64 16.13,10.79 19.05,7.87 v19.94,7.87
SCK  (via drill 0.25)
  Top 0.254: U2.17 25.66,15.23 25.65,15.24 v25.65,15.88
  Bottom 0.254: v25.65,15.88 24.96,16.56 24.96,19.55 22.86,21.65 ISP1.3
SCL  (via drill 0.25)
  Top 0.254: U1.10 33.02,18.46 v32.59,18.88 32.11,19.36 30.89,19.36 30.1,20.15 R3.1 | U2.28 19.92,10.31 v19.94,10.29
  Bottom 0.254: v19.94,10.29 22.02,10.29 22.22,10.49 27.5,10.49 32.59,15.58 v32.59,18.88
SDA  (via drill 0.25)
  Top 0.254: U1.9 33.79,19.55 v33.47,19.88 33.19,20.15 R2.1 | U2.27 19.87,11.11 v19.94,11.18
  Bottom 0.254: v19.94,11.18 27.62,11.18 31.88,15.43 31.88,18.91 32.84,19.88 v33.47,19.88
TX  (via drill 0.25)
  Top 0.254: U4.1 16.54,18.89 v16.64,18.8 | v19.94,8.64 18.64,8.64 U2.30
  Bottom 0.254: v16.64,18.8 16.64,10.86 18.86,8.64 v19.94,8.64

### Text on the board
tPlace: /Volumes/OSX_Storage/Downloads/Untitled.bmp
tDocu: POWER | RESET | USB | AUX | 5V | 3V3 | Project Bonnet
bDocu: Project Bonnet / Desktop Mini / Bobby Schulz / v0.0 | 5V | 3V3 | A3 | A2 | A1 | A0 | D0 | GND